# EAGLE schematic SI4844_setup (EAGLE 9.6.2)
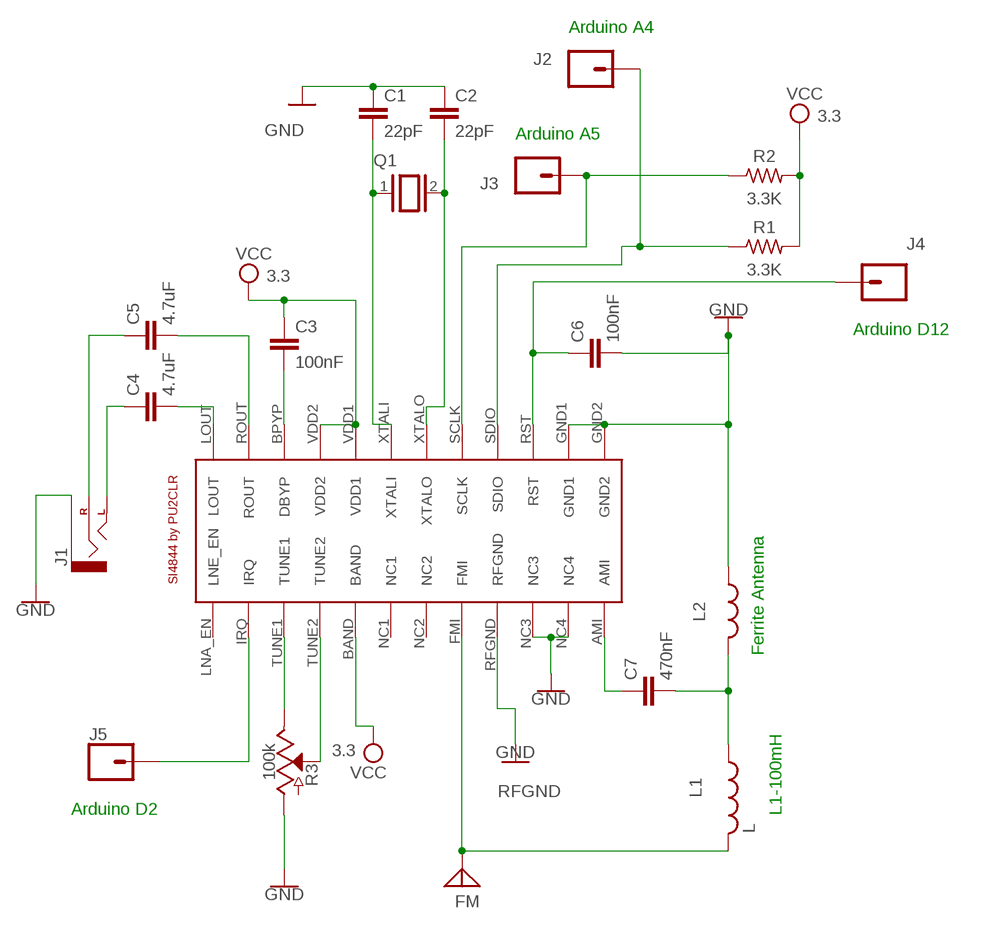
[diagram p0: schematic, sheet 1]

## Parts
C1  22pF  C2,5-3  [C2.5-3]
C2  22pF  C2,5-3  [C2.5-3]
C3  100nF  C2,5-3  [C2.5-3]
C4  4.7uF  C2,5-3  [C2.5-3]
C5  4.7uF  C2,5-3  [C2.5-3]
C6  100nF  C2,5-3  [C2.5-3]
C7  470nF  C2,5-3  [C2.5-3]
FM  ANTENNA  [PAD-01]
J1  AUDIO_JACK_2.5MMSPECIAL_POGO_PINS  [STEREOJACK2.5MM_SPECIAL_POGOPINS]
J2  CONN_01  [1X01]
J3  CONN_01  [1X01]
J4  CONN_01  [1X01]
J5  CONN_01  [1X01]
L1  L  [6000]
L2  L  (no package)
Q1  XTAL  [Q]
R1  3.3K  R-US_AXIAL-7.2MM-PITCH  [RESAD724W46L381D178B]
R2  3.3K  R-US_AXIAL-7.2MM-PITCH  [RESAD724W46L381D178B]
R3  100k  POTENTIOMETER-PTH-9MM-1/20W-20%  [POT-PTH-ALPS]
SI1  SI4844  [SSOP24]

## Nets
ARDUINO_A4: J2.1 R1.1 SI1.SDIO
ARDUINO_A5: J3.1 R2.1 SI1.SCLK
GND: C1.1 C2.1 C6.2 J1.RING1(SLEEVE) L2.1 R3.P$3(A) SI1.GND1 SI1.GND2 SI1.NC3 SI1.NC4 SI1.RFGND
N$1: J5.1 SI1.IRQ
N$12: C1.2 Q1.1 SI1.XTALI
N$13: C2.2 Q1.2 SI1.XTALO
N$14: FM.1 L1.2 SI1.FMI
N$15: C7.1 SI1.AMI
N$16: C7.2 L1.1 L2.2
N$17: C5.1 J1.TIP(RIGHT)
N$18: C4.1 J1.SHIELD(LEFT)
N$20: C3.2 SI1.BPYP(DBYP)
N$22: C6.1 J4.1 SI1.RST
N$28: R3.P$1(E) SI1.TUNE1
N$29: R3.P$2(S) SI1.TUNE2
N$31: C4.2 SI1.LOUT
N$32: C5.2 SI1.ROUT
VCC: C3.1 R1.2 R2.2 SI1.BAND SI1.VDD1 SI1.VDD2
Unconnected: SI1.LNA_EN(LNE_EN) SI1.NC1 SI1.NC2

## Notes on the sheet
- Arduino A4
- Arduino A5
- Arduino D12
- Ferrite Antenna
- Arduino D2 | L1-100mH

## Library data of the parts
C1-C7 = capacitor-wima:C: CAPACITOR naming: grid - package width
FM = discrete:ANTENNA: Antenna
J1 = SparkFun-Connectors:AUDIO_JACK_2.5MM: Audio Jack 2.5mm variants of PTH and SMT audio jacks. SparkFun Products: SparkFun PicoBoard <https://www.sparkfun.com/products/11888>- 2.5mm SMD
J2-J5 = SparkFun-Connectors:CONN_01: Single connection point. Often used as Generic Header-pin footprint for 0.1 inch spaced/style header connections On any of the 0.1 inch spaced packages, you can populate with these: Break Away Headers - Straight <https://www.sparkfun.com/products/116> (PRT-00116) Break Away Male Headers - Right Angle <https://www.sparkfun.com/products/553> (PRT-00553) Female Headers <https://www.sparkfun.com/products/115> (PRT-00115) Break Away Headers - Machine Pin <https://www.sparkfun.com/products/117> (PRT-00117) Break Away Female Headers - Swiss Machine Pin <https://www.sparkfun.com/products/743> (PRT-00743) This device is also useful as a general connection point to wire up your design to another part of your project. Our various solder wires solder well into these plated through hole pads. Hook-Up Wire - Assortment (Stranded, 22 AWG) <https://www.sparkfun.com/products/11375> (PRT-11375) Hook-Up Wire - Assortment (Solid Core, 22 AWG) <https://www.sparkfun.com/products/11367> (PRT-11367) View the entire wire category on our website here <https://www.sparkfun.com/categories/141> Special notes: SMTSO-256-ET is a "flush mount" nut for a 4-40 screw. We mostly use this on specialty testbeds; it is a nice way to connect hardware to your PCB at an adjustable hieght. Also note, the SNAP packages are for using a snappable style connector. We sell a baggie of snaps and they are also used on two LilyPad designs: Snap Assortment - 30 pack (male and female) <https://www.sparkfun.com/products/11347> (DEV-11347) LilyPad Arduino SimpleSnap <https://www.sparkfun.com/products/10941> (DEV-10941) LilyPad SimpleSnap Protoboard <https://www.sparkfun.com/products/10940> (DEV-10940)
L1 = adafruit:L
L2 = ngspice-simulation:L: INDUCTOR
Q1 = special:XTAL: CRYSTAL
R1 R2 = Resistor:R-US: Resistor Fixed - ANSI; CATEGORY: Resistor; SUB-CATEGORY: Fixed
R3 = SparkFun-Resistors:POTENTIOMETER: Potentiometer (Pot) Three-terminal potentiometers, with an adjustable wiper and two adjustable resistors. A pot can be used to create a configurable voltage divider, or as a variable resistor. Variants ALPS_POT and ALPS_POT_KIT - PTH, breadboard compatible, 9mm square pots Rotary Potentiometer - Linear (10k ohm) <https://www.sparkfun.com/products/9288> (COM-09288) The KIT variant exposes copper on only one side of the PTH pad, so the part can only be assembled on one side of the PCB. Useful for beginner soldering kits.; PROD_ID: RES-09177; SF_SKU: COM-09288; VALUE: 10k
SI1 = SI4844_PU2CLR:SI4844